# Altium schematic sheet 13_MRAM_RTC_WDT.SchDoc
size 420 x 297 mm; SheetNumber: 22; SheetTotal: 33
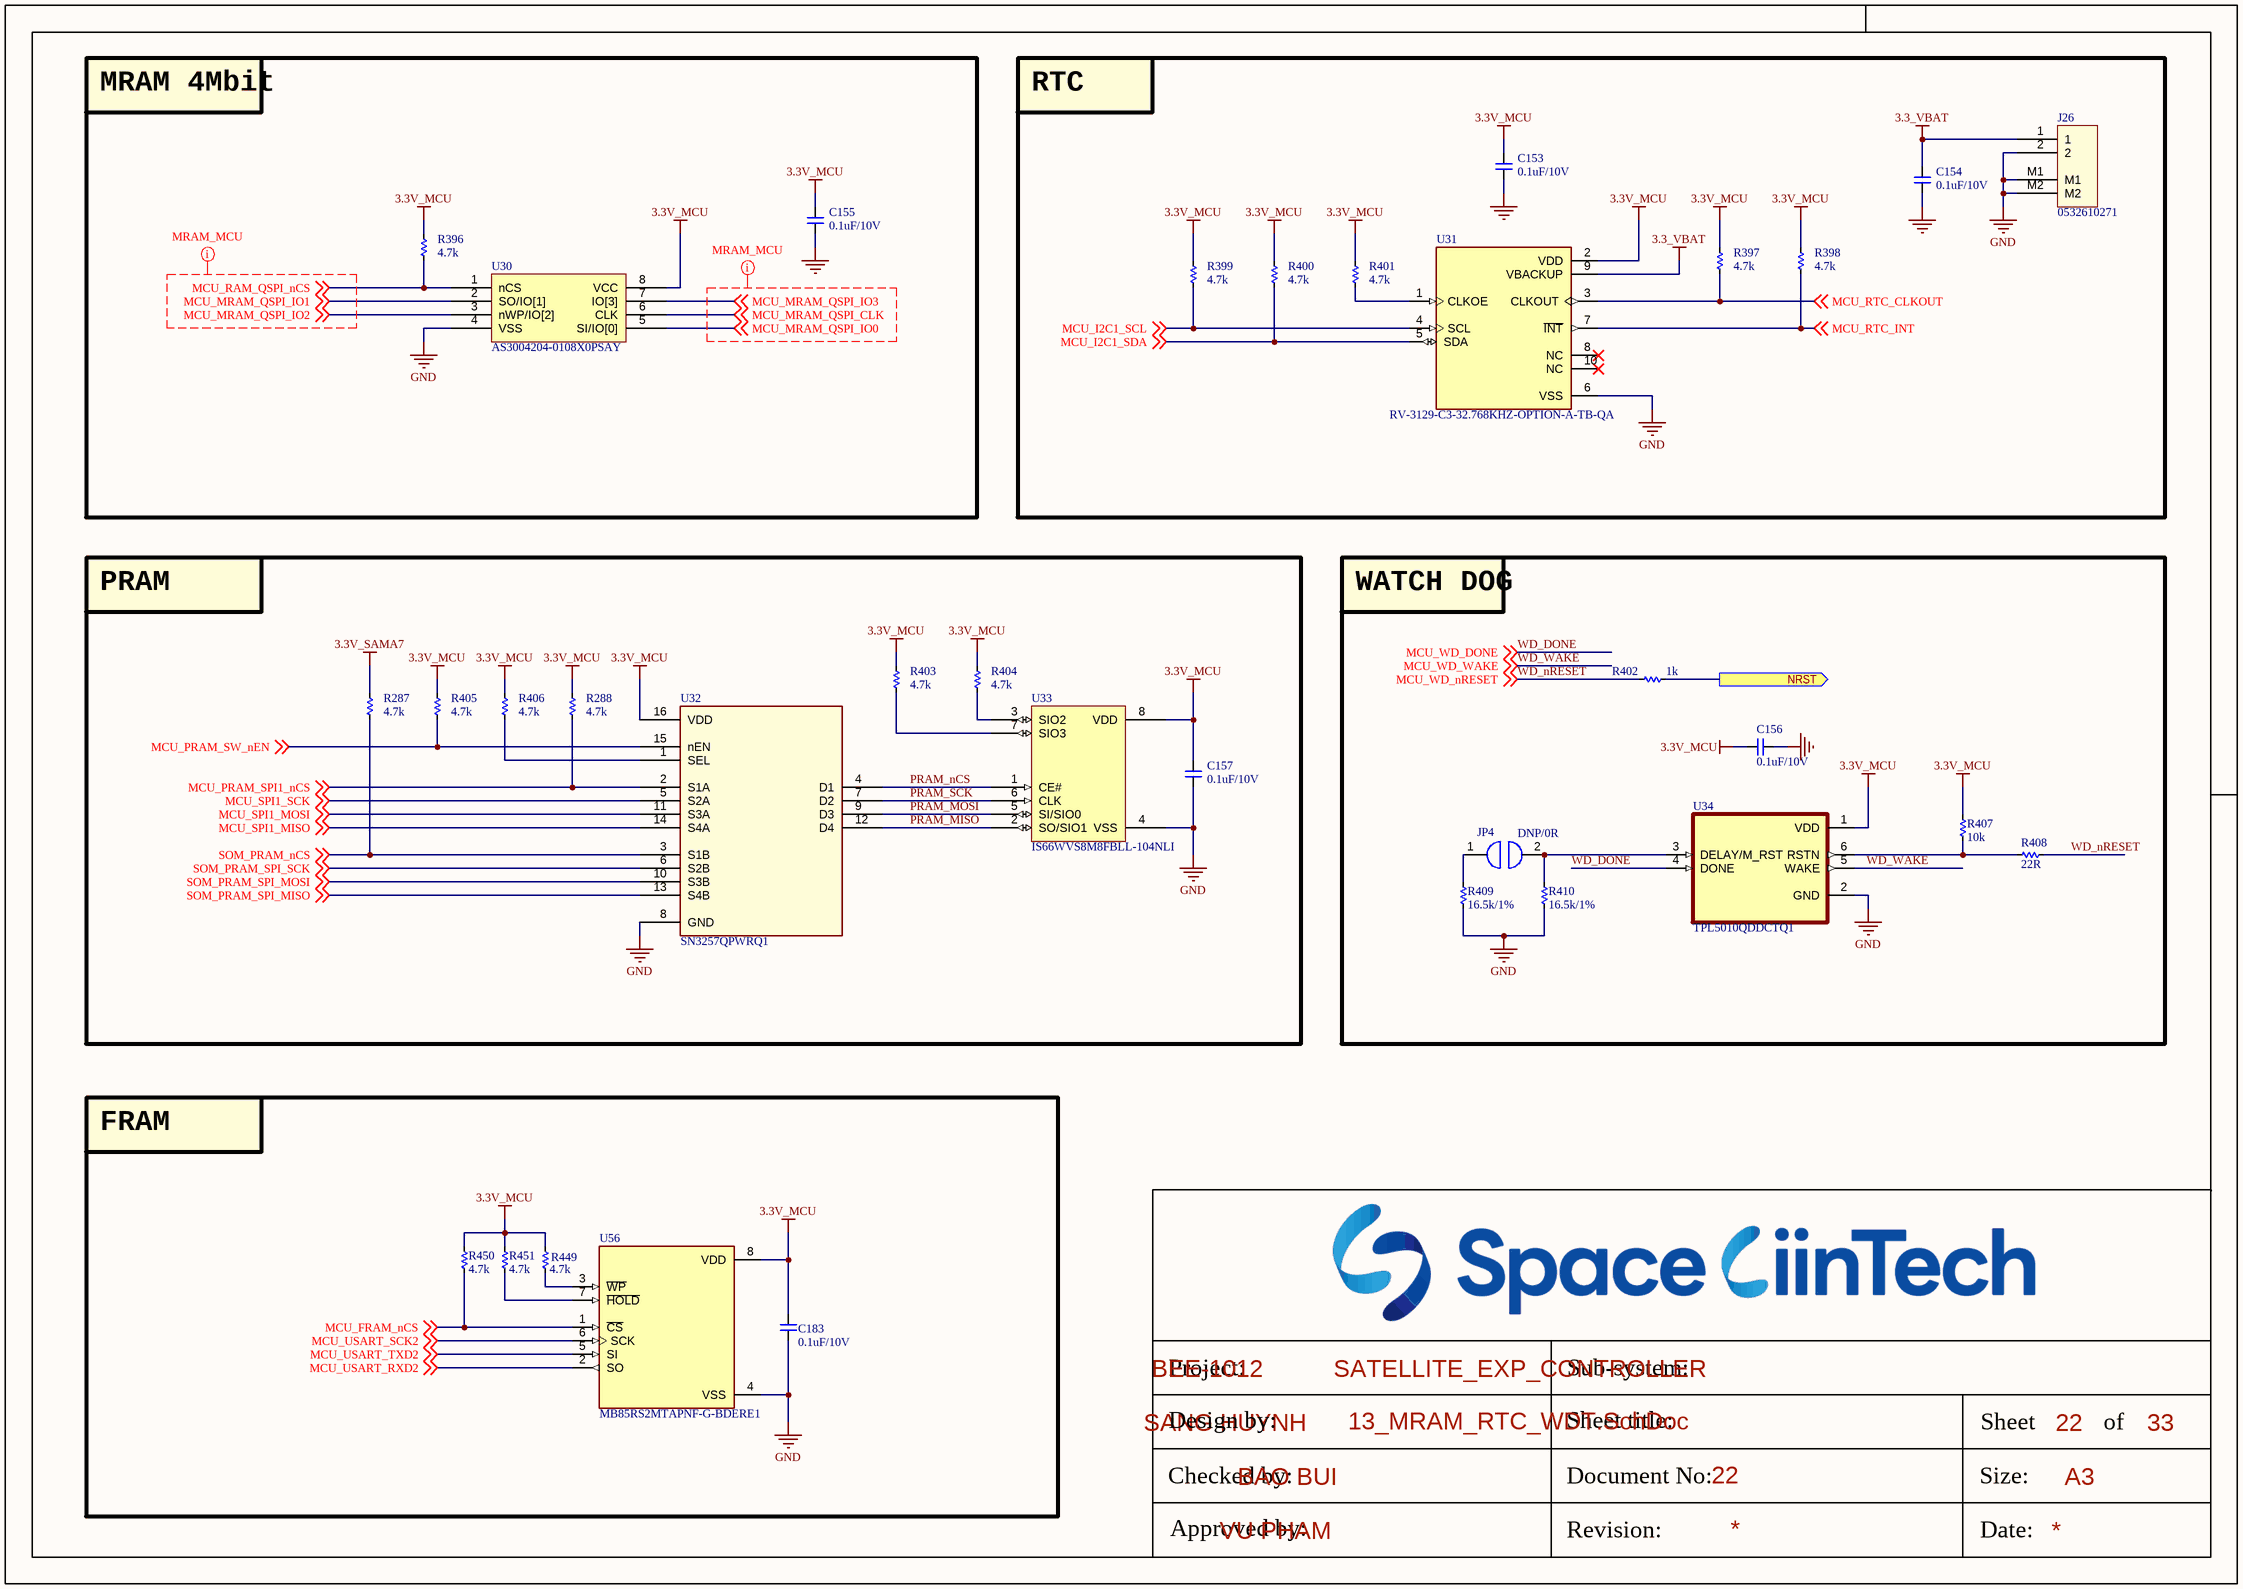
[diagram p0: 13_MRAM_RTC_WDT.SchDoc]

## Parts
C153  0.1uF/10V  [CAP_C_1005X50_L]
C154  0.1uF/10V  [CAP_C_1005X50_L]
C155  0.1uF/10V  [CAP_C_1005X50_L]
C156  0.1uF/10V  [CAP_C_1005X50_L]
C157  0.1uF/10V  [CAP_C_1005X50_L]
C183  0.1uF/10V  [CAP_C_1005X50_L]
J26  0532610271  [molex_0532610271]
JP4  DNP/0R  [JUMPER_1608]
R287  4.7k  [RES_C_1005x30_L]
R288  4.7k  [RES_C_1005x30_L]
R396  4.7k  [RES_C_1005x30_L]
R397  4.7k  [RES_C_1005x30_L]
R398  4.7k  [RES_C_1005x30_L]
R399  4.7k  [RES_C_1005x30_L]
R400  4.7k  [RES_C_1005x30_L]
R401  4.7k  [RES_C_1005x30_L]
R402  1k  [RES_C_1005x30_L]
R403  4.7k  [RES_C_1005x30_L]
R404  4.7k  [RES_C_1005x30_L]
R405  4.7k  [RES_C_1005x30_L]
R406  4.7k  [RES_C_1005x30_L]
R407  10k  [RES_C_1005x30_L]
R408  22R  [RES_C_1005x30_L]
R409  16.5k/1%  [RES_C_1005x30_L]
R410  16.5k/1%  [RES_C_1005x30_L]
R449  4.7k  [RES_C_1005x30_L]
R450  4.7k  [RES_C_1005x30_L]
R451  4.7k  [RES_C_1005x30_L]
U30  AS3004204-0108X0PSAY  [SOIC127P790X216-8]
U31  RV-3129-C3-32.768KHZ-OPTION-A-TB-QA  [IC_RV-3129-C3_32.768KHZ_OPTION_A_TB_QA]
U32  SN3257QPWRQ1  [SOIC_PRQ1_TEX]
U33  IS66WVS8M8FBLL-104NLI  [SOIC8_150MIL_N_ISI]
U34  TPL5010QDDCTQ1  [SOT95P280X145-6N]
U56  MB85RS2MTAPNF-G-BDERE1  [SOIC127P602X173-8N]

## Blocks framed on the sheet
MRAM 4Mbit: C155 R396 U30
RTC: C153 C154 J26 R397-R401 U31
PRAM: C157 R287 R288 R403-R406 U32 U33
WATCH DOG: C156 JP4 R402 R407-R410 U34
FRAM: C183 R449-R451 U56

## Ports
NRST (out)

## Nets
3.3_VBAT: C154.2 J26.1 U31.9(VBACKUP)
3.3V_MCU: C153.2 C155.2 C156.2 C157.1 C183.2 R288.2 R396.2 R397.2 R398.2 R399.2 R400.2 R401.1 R403.2 R404.2 R405.2 R406.2 R407.2 R449.2 R450.2 R451.2 U30.8(VCC) U31.2(VDD) U32.16(VDD) U33.8(VDD) U34.1(VDD) U56.8(VDD)
3.3V_SAMA7: R287.2
GND: C153.1 C154.1 C155.1 C156.1 C157.2 C183.1 J26.2 J26.M1 J26.M2 R409.1 R410.1 U30.4(VSS) U31.6(VSS) U32.8(GND) U33.4(VSS) U34.2(GND) U56.4(VSS)
MCU_FRAM_nCS: R450.1 U56.1(~{CS}) ; off-sheet MCU_FRAM_nCS
MCU_I2C1_SCL: R399.1 U31.4(SCL) ; off-sheet MCU_I2C1_SCL
MCU_I2C1_SDA: R400.1 U31.5(SDA) ; off-sheet MCU_I2C1_SDA
MCU_MRAM_QSPI_CLK: U30.6(CLK) ; off-sheet MCU_MRAM_QSPI_CLK
MCU_MRAM_QSPI_IO0: U30.5(SI/IO[0]) ; off-sheet MCU_MRAM_QSPI_IO0
MCU_MRAM_QSPI_IO1: U30.2(SO/IO[1]) ; off-sheet MCU_MRAM_QSPI_IO1
MCU_MRAM_QSPI_IO2: U30.3(nWP/IO[2]) ; off-sheet MCU_MRAM_QSPI_IO2
MCU_MRAM_QSPI_IO3: U30.7(IO[3]) ; off-sheet MCU_MRAM_QSPI_IO3
MCU_PRAM_SPI1_nCS: R288.1 U32.2(S1A) ; off-sheet MCU_PRAM_SPI1_nCS
MCU_PRAM_SW_nEN: R405.1 U32.15(nEN) ; off-sheet MCU_PRAM_SW_nEN
MCU_RAM_QSPI_nCS: R396.1 U30.1(nCS) ; off-sheet MCU_RAM_QSPI_nCS
MCU_RTC_CLKOUT: R397.1 U31.3(CLKOUT) ; off-sheet MCU_RTC_CLKOUT
MCU_RTC_INT: R398.1 U31.7(~{INT}) ; off-sheet MCU_RTC_INT
MCU_SPI1_MISO: U32.14(S4A) ; off-sheet MCU_SPI1_MISO
MCU_SPI1_MOSI: U32.11(S3A) ; off-sheet MCU_SPI1_MOSI
MCU_SPI1_SCK: U32.5(S2A) ; off-sheet MCU_SPI1_SCK
MCU_USART_RXD2: U56.2(SO) ; off-sheet MCU_USART_RXD2
MCU_USART_SCK2: U56.6(SCK) ; off-sheet MCU_USART_SCK2
MCU_USART_TXD2: U56.5(SI) ; off-sheet MCU_USART_TXD2
NRST: R402.1 ; port NRST
PRAM_MISO: U32.12(D4) U33.2(SO/SIO1)
PRAM_MOSI: U32.9(D3) U33.5(SI/SIO0)
PRAM_nCS: U32.4(D1) U33.1(CE#)
PRAM_SCK: U32.7(D2) U33.6(CLK)
SOM_PRAM_nCS: R287.1 U32.3(S1B) ; off-sheet SOM_PRAM_nCS
SOM_PRAM_SPI_MISO: U32.13(S4B) ; off-sheet SOM_PRAM_SPI_MISO
SOM_PRAM_SPI_MOSI: U32.10(S3B) ; off-sheet SOM_PRAM_SPI_MOSI
SOM_PRAM_SPI_SCK: U32.6(S2B) ; off-sheet SOM_PRAM_SPI_SCK
WD_DONE: U34.4(DONE) ; off-sheet MCU_WD_DONE  [also labelled MCU_WD_DONE]
WD_nRESET: R402.2 R408.1 ; off-sheet MCU_WD_nRESET  [also labelled MCU_WD_nRESET]
WD_WAKE: U34.5(WAKE) ; off-sheet MCU_WD_WAKE  [also labelled MCU_WD_WAKE]
NetJP4_1: JP4.1 R409.2
NetJP4_2: JP4.2 R410.2 U34.3(DELAY/M_RST)
NetR401_2: R401.2 U31.1(CLKOE)
NetR403_1: R403.1 U33.7(SIO3)
NetR404_1: R404.1 U33.3(SIO2)
NetR406_1: R406.1 U32.1(SEL)
NetR407_1: R407.1 R408.2 U34.6(RSTN)
NetR449_1: R449.1 U56.3(~{WP})
NetR451_1: R451.1 U56.7(~{HOLD})

Not connected (* = marked no-connect by the designer): U31 8(NC)* 10(NC)*

## Layout directives
net class MRAM_MCU: MCU_MRAM_QSPI_CLK, MCU_MRAM_QSPI_IO0, MCU_MRAM_QSPI_IO1, MCU_MRAM_QSPI_IO2, MCU_MRAM_QSPI_IO3, MCU_RAM_QSPI_nCS

## Notes on the sheet
- Project:
- BEE-1012
- Sub-system:
- SATELLITE_EXP_CONTROLLER
- Design by:
- SANG HUYNH
- BAO BUI
- Sheet title:
- Sheet
- A3
- of
- Checked by:
- Approved by:
- VU PHAM
- Revision:
- Document No:
- Size:
- Date:

## Library data of the parts
C153-C157 = _CAP_C_2: CAP
C183 = _CAP_C_2: CAP CHIP
J26 = Header 2x1_2M
JP4 = JUMPER
R287 R288 R396-R410 R449-R451 = _RES_B_2: RES
U30 = IC_RAM_AS3004204-0108X0PSAY
U31 = RV-3129-C3_32.768KHZ_OPTION_A_TB_QA: Real-Time Clock Module, Temperature compensated, in 2.5 x 3.7 mm package; MF: Micro Crystal; MP: RV-3129-C3 32.768KHZ OPTION A TB QA; SnapEDA_Link: https://www.snapeda.com/parts/RV-3129-C3%2032.768KHZ%20OPTION%20A%20TB%20QA/Micro+Crystal/view-part/?ref=snap; Package: QFN-10 Micro Crystal; Value: *; Check_prices: https://www.snapeda.com/parts/RV-3129-C3%2032.768KHZ%20OPTION%20A%20TB%20QA/Micro+Crystal/view-part/?ref=eda
U32 = IC_SW_SPI_SN3257QPWRQ1: Automotive 5-V, 2:1 (SPDT), 4-channel switch with 1.8-V logic and powered-off protection 16-TSSOP -40 to 125; Manufacturer_Name: Texas Instruments; Copyright: Copyright (C) 2025 Ultra Librarian. All rights reserved.; Manufacturer_Part_Number: SN3257QPWRQ1; Datasheet: https://www.ti.com/lit/gpn/sn3257-q1; RefDes: RefDes; Type: Type
U33 = IS66WVS4M8BLL-104NLI: No Description Available; Manufacturer_Name: ISSI; Type: Memory; Copyright: Copyright (C) 2025 Ultra Librarian. All rights reserved.; Manufacturer_Part_Number: IS66WVS4M8BLL-104NLI; RefDes: RefDes
U56 = MB85RS2MTAPNF-G-BDERE1: FRAM _Ferroelectric RAM_ Memory IC 2Mb _256K x 8_ SPI 40MHz 8-SOP; MF: Fujitsu Electronics; Package: SO-8 Fujitsu; Value: *; Digi-Key_Purchase_URL: https://www.digikey.com/product-detail/en/fujitsu-electronics-america-inc/MB85RS2MTAPNF-G-BDERE1/865-1286-1-ND/7916252?utm_source=snapeda&utm_medium=aggregator&utm_campaign=symbol; Digi-Key_Part_Number: 865-1286-1-ND; SnapEDA_Link: https://www.snapeda.com/parts/MB85RS2MTAPNF-G-BDERE1/Fujitsu%20Electronics%20America%2C%20Inc./view-part/2344795/?ref=snap; MP: MB85RS2MTAPNF-G-BDERE1
U34 = TPL5010QDDCTQ1: Package: None; Price: None; Value: *; MP: TPL5010QDDCTQ1; Availability: Unavailable